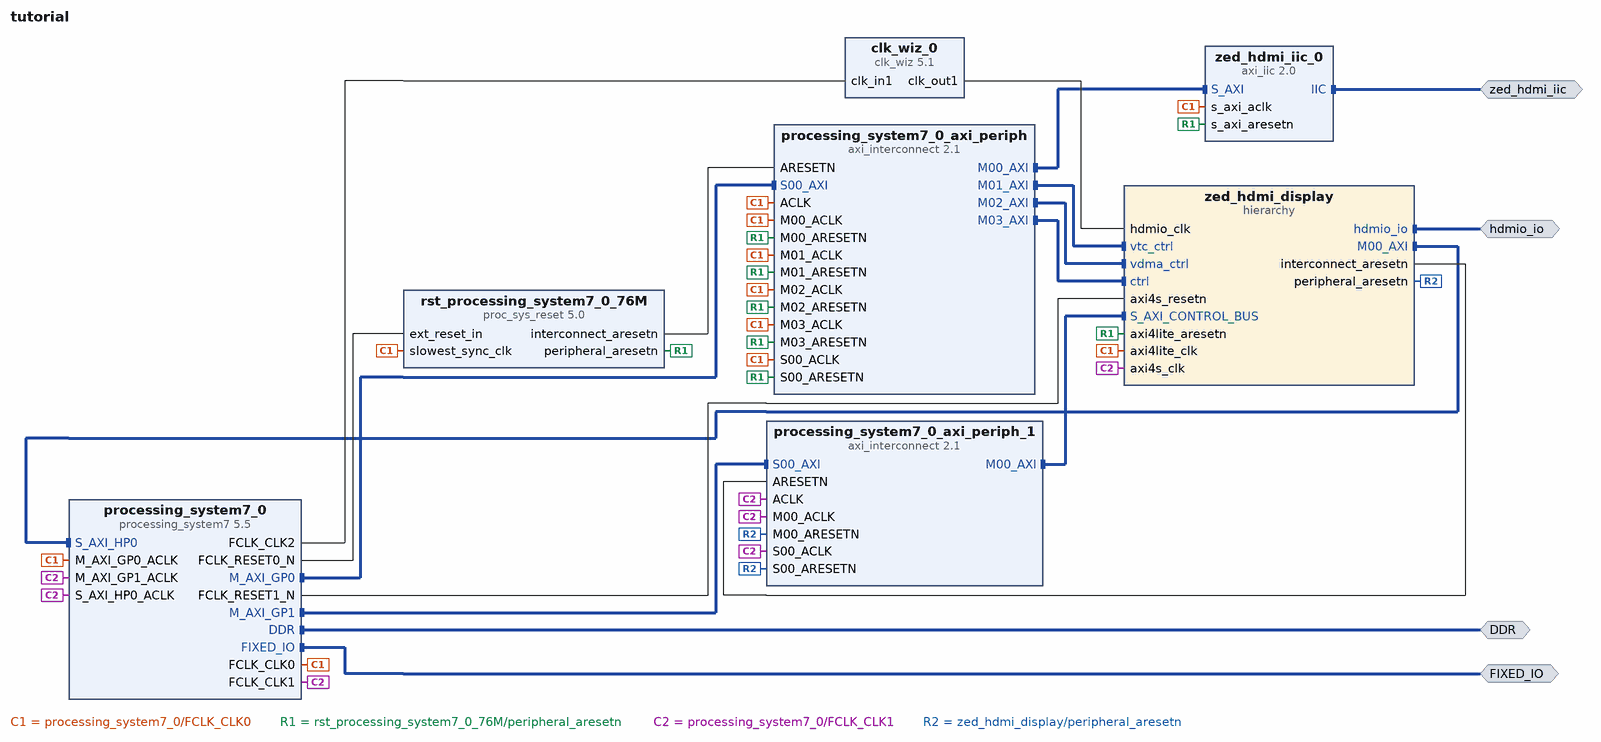
[diagram p0: block diagram of the top level]
# Vivado block design tutorial, Vivado 2014.4.1
create_bd_design tutorial

create_bd_intf_port -mode Master -vlnv xilinx.com:interface:ddrx_rtl:1.0 DDR
create_bd_intf_port -mode Master -vlnv xilinx.com:display_processing_system7:fixedio_rtl:1.0 FIXED_IO
create_bd_intf_port -mode Master -vlnv xilinx.com:interface:iic_rtl:1.0 zed_hdmi_iic
create_bd_intf_port -mode Master -vlnv avnet.com:interface:avnet_hdmi_rtl:1.0 hdmio_io

create_bd_cell -type hier zed_hdmi_display
create_bd_cell -type ip -vlnv xilinx.com:ip:axi_iic:2.0 zed_hdmi_iic_0
create_bd_cell -type ip -vlnv xilinx.com:ip:clk_wiz:5.1 clk_wiz_0
set_property -dict [list \
  CONFIG.CLKOUT1_REQUESTED_OUT_FREQ 148.500 \
  CONFIG.USE_LOCKED false \
  CONFIG.USE_RESET false \
] [get_bd_cells clk_wiz_0]
create_bd_cell -type ip -vlnv xilinx.com:ip:processing_system7:5.5 processing_system7_0
set_property -dict [list \
  CONFIG.PCW_FPGA0_PERIPHERAL_FREQMHZ 75.000000 \
  CONFIG.PCW_FPGA2_PERIPHERAL_FREQMHZ 100.000000 \
  CONFIG.PCW_USE_M_AXI_GP1 1 \
  CONFIG.PCW_USE_S_AXI_HP0 1 \
  CONFIG.PCW_EN_CLK1_PORT 1 \
  CONFIG.PCW_EN_CLK2_PORT 1 \
  CONFIG.PCW_EN_RST1_PORT 1 \
  CONFIG.preset {ZedBoard*} \
] [get_bd_cells processing_system7_0]
create_bd_cell -type ip -vlnv xilinx.com:ip:axi_interconnect:2.1 processing_system7_0_axi_periph
set_property -dict [list \
  CONFIG.NUM_SI 1 \
  CONFIG.NUM_MI 4 \
  CONFIG.STRATEGY 1 \
  CONFIG.ENABLE_ADVANCED_OPTIONS 1 \
] [get_bd_cells processing_system7_0_axi_periph]
create_bd_cell -type ip -vlnv xilinx.com:ip:proc_sys_reset:5.0 rst_processing_system7_0_76M
create_bd_cell -type ip -vlnv xilinx.com:ip:axi_interconnect:2.1 processing_system7_0_axi_periph_1
set_property -dict {CONFIG.NUM_MI 1} [get_bd_cells processing_system7_0_axi_periph_1]

# ---- hierarchy /zed_hdmi_display ----
current_bd_instance /zed_hdmi_display
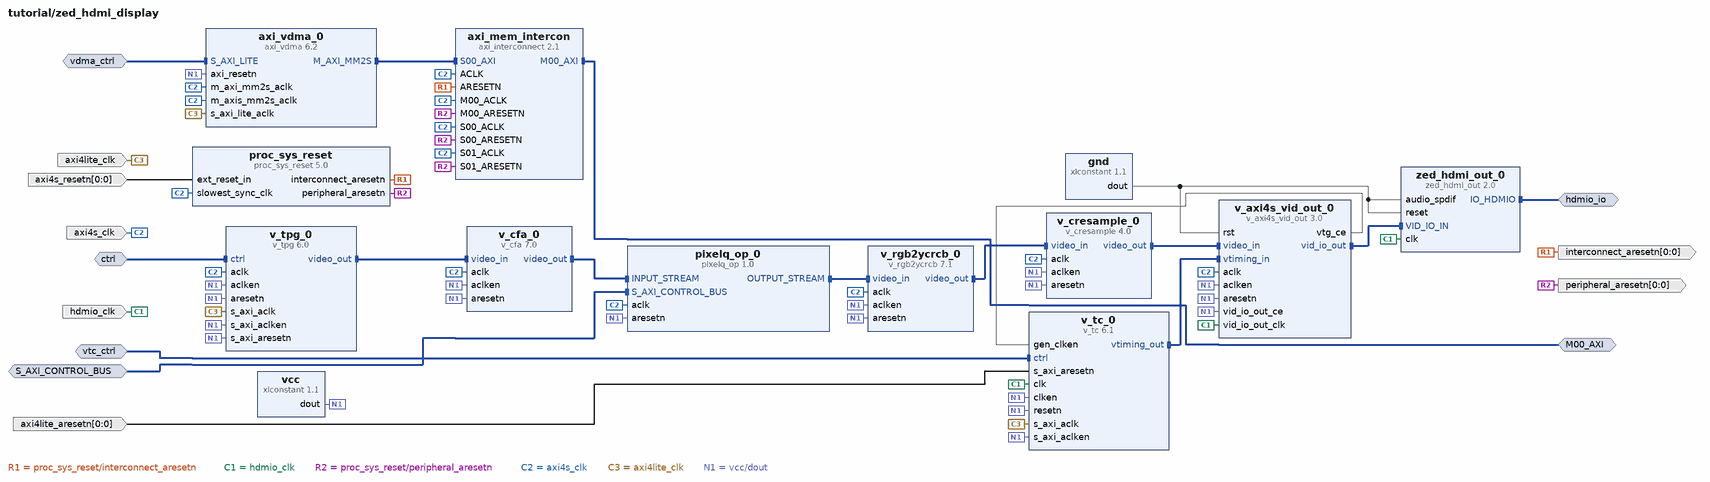
[diagram p1: block diagram inside /zed_hdmi_display]
create_bd_intf_pin -mode Master -vlnv xilinx.com:interface:aximm_rtl:1.0 M00_AXI
create_bd_intf_pin -mode Master -vlnv avnet.com:interface:avnet_hdmi_rtl:1.0 hdmio_io
create_bd_intf_pin -mode Slave -vlnv xilinx.com:interface:aximm_rtl:1.0 vdma_ctrl
create_bd_intf_pin -mode Slave -vlnv xilinx.com:interface:aximm_rtl:1.0 vtc_ctrl
create_bd_intf_pin -mode Slave -vlnv xilinx.com:interface:aximm_rtl:1.0 ctrl
create_bd_intf_pin -mode Slave -vlnv xilinx.com:interface:aximm_rtl:1.0 S_AXI_CONTROL_BUS
create_bd_pin -dir I -from 0 -to 0 axi4lite_aresetn
create_bd_pin -dir I axi4lite_clk
create_bd_pin -dir I -type clk axi4s_clk
create_bd_pin -dir I -from 0 -to 0 axi4s_resetn
create_bd_pin -dir I hdmio_clk
create_bd_pin -dir O -from 0 -to 0 -type rst peripheral_aresetn
create_bd_pin -dir O -from 0 -to 0 -type rst interconnect_aresetn

create_bd_cell -type ip -vlnv avnet:zedboard:zed_hdmi_out:2.0 zed_hdmi_out_0
create_bd_cell -type ip -vlnv xilinx.com:ip:axi_interconnect:2.1 axi_mem_intercon
set_property -dict {CONFIG.NUM_SI 2 CONFIG.NUM_MI 1} [get_bd_cells axi_mem_intercon]
create_bd_cell -type ip -vlnv xilinx.com:ip:axi_vdma:6.2 axi_vdma_0
set_property -dict [list \
  CONFIG.c_mm2s_genlock_mode 0 \
  CONFIG.c_mm2s_linebuffer_depth 4096 \
  CONFIG.c_include_s2mm 0 \
  CONFIG.c_enable_debug_info_6 0 \
  CONFIG.c_enable_debug_info_7 0 \
  CONFIG.c_enable_debug_info_14 0 \
  CONFIG.c_enable_debug_info_15 0 \
  CONFIG.c_include_mm2s_dre 1 \
] [get_bd_cells axi_vdma_0]
create_bd_cell -type ip -vlnv xilinx.com:ip:xlconstant:1.1 gnd
set_property -dict {CONFIG.CONST_VAL 0} [get_bd_cells gnd]
create_bd_cell -type ip -vlnv xilinx.com:ip:proc_sys_reset:5.0 proc_sys_reset
set_property -dict {CONFIG.C_AUX_RESET_HIGH 0} [get_bd_cells proc_sys_reset]
create_bd_cell -type ip -vlnv xilinx.com:ip:v_axi4s_vid_out:3.0 v_axi4s_vid_out_0
set_property -dict {CONFIG.C_S_AXIS_VIDEO_FORMAT 0 CONFIG.VTG_MASTER_SLAVE 1} [get_bd_cells v_axi4s_vid_out_0]
create_bd_cell -type ip -vlnv xilinx.com:ip:v_cresample:4.0 v_cresample_0
set_property -dict {CONFIG.s_axis_video_format 3 CONFIG.m_axis_video_format 2} [get_bd_cells v_cresample_0]
create_bd_cell -type ip -vlnv xilinx.com:ip:v_rgb2ycrcb:7.1 v_rgb2ycrcb_0
create_bd_cell -type ip -vlnv xilinx.com:ip:v_tc:6.1 v_tc_0
set_property -dict {CONFIG.VIDEO_MODE 1080p CONFIG.enable_detection false} [get_bd_cells v_tc_0]
create_bd_cell -type ip -vlnv xilinx.com:ip:xlconstant:1.1 vcc
create_bd_cell -type ip -vlnv xilinx.com:ip:v_tpg:6.0 v_tpg_0
set_property -dict [list \
  CONFIG.has_axi4s_slave false \
  CONFIG.data_width 8 \
  CONFIG.pattern_control 10 \
  CONFIG.m_video_format 12 \
  CONFIG.bayer_phase 2 \
] [get_bd_cells v_tpg_0]
create_bd_cell -type ip -vlnv xilinx.com:ip:v_cfa:7.0 v_cfa_0
set_property -dict [list \
  CONFIG.has_axi4_lite false \
  CONFIG.hor_filt true \
  CONFIG.fringe_tol 0 \
  CONFIG.bayer_phase 2 \
] [get_bd_cells v_cfa_0]
create_bd_cell -type ip -vlnv xilinx.com:hls:pixelq_op:1.0 pixelq_op_0

# ---- connections ----

current_bd_instance /zed_hdmi_display
connect_bd_intf_net [get_bd_intf_pins axi_mem_intercon/S00_AXI] [get_bd_intf_pins axi_vdma_0/M_AXI_MM2S]
connect_bd_intf_net [get_bd_intf_pins v_axi4s_vid_out_0/vid_io_out] [get_bd_intf_pins zed_hdmi_out_0/VID_IO_IN]
connect_bd_intf_net [get_bd_intf_pins v_axi4s_vid_out_0/video_in] [get_bd_intf_pins v_cresample_0/video_out]
connect_bd_intf_net [get_bd_intf_pins v_cresample_0/video_in] [get_bd_intf_pins v_rgb2ycrcb_0/video_out]
connect_bd_intf_net [get_bd_intf_pins v_axi4s_vid_out_0/vtiming_in] [get_bd_intf_pins v_tc_0/vtiming_out]
connect_bd_intf_net [get_bd_intf_pins v_tpg_0/video_out] [get_bd_intf_pins v_cfa_0/video_in]
connect_bd_intf_net [get_bd_intf_pins pixelq_op_0/OUTPUT_STREAM] [get_bd_intf_pins v_rgb2ycrcb_0/video_in]
connect_bd_intf_net [get_bd_intf_pins pixelq_op_0/INPUT_STREAM] [get_bd_intf_pins v_cfa_0/video_out]
connect_bd_intf_net [get_bd_intf_pins M00_AXI] [get_bd_intf_pins axi_mem_intercon/M00_AXI]
connect_bd_intf_net [get_bd_intf_pins hdmio_io] [get_bd_intf_pins zed_hdmi_out_0/IO_HDMIO]
connect_bd_intf_net [get_bd_intf_pins vdma_ctrl] [get_bd_intf_pins axi_vdma_0/S_AXI_LITE]
connect_bd_intf_net [get_bd_intf_pins vtc_ctrl] [get_bd_intf_pins v_tc_0/ctrl]
connect_bd_intf_net [get_bd_intf_pins ctrl] [get_bd_intf_pins v_tpg_0/ctrl]
connect_bd_intf_net [get_bd_intf_pins S_AXI_CONTROL_BUS] [get_bd_intf_pins pixelq_op_0/S_AXI_CONTROL_BUS]
connect_bd_net -net aresetn_1 [get_bd_pins proc_sys_reset/interconnect_aresetn] \
  [get_bd_pins interconnect_aresetn] [get_bd_pins axi_mem_intercon/ARESETN]
connect_bd_net -net clk_1 [get_bd_pins hdmio_clk] \
  [get_bd_pins zed_hdmi_out_0/clk] [get_bd_pins v_axi4s_vid_out_0/vid_io_out_clk] [get_bd_pins v_tc_0/clk]
connect_bd_net -net ext_reset_in_1 [get_bd_pins axi4s_resetn] [get_bd_pins proc_sys_reset/ext_reset_in]
connect_bd_net -net gnd_const [get_bd_pins gnd/dout] \
  [get_bd_pins zed_hdmi_out_0/audio_spdif] [get_bd_pins zed_hdmi_out_0/reset] [get_bd_pins v_axi4s_vid_out_0/rst]
connect_bd_net [get_bd_pins proc_sys_reset/peripheral_aresetn] \
  [get_bd_pins peripheral_aresetn] [get_bd_pins axi_mem_intercon/S00_ARESETN] [get_bd_pins axi_mem_intercon/M00_ARESETN] \
  [get_bd_pins axi_mem_intercon/S01_ARESETN]
connect_bd_net -net processing_system7_0_fclk_clk1 [get_bd_pins axi4s_clk] \
  [get_bd_pins axi_vdma_0/m_axi_mm2s_aclk] [get_bd_pins axi_vdma_0/m_axis_mm2s_aclk] \
  [get_bd_pins proc_sys_reset/slowest_sync_clk] [get_bd_pins v_axi4s_vid_out_0/aclk] [get_bd_pins v_cresample_0/aclk] \
  [get_bd_pins v_rgb2ycrcb_0/aclk] [get_bd_pins v_tpg_0/aclk] [get_bd_pins v_cfa_0/aclk] [get_bd_pins axi_mem_intercon/ACLK] \
  [get_bd_pins axi_mem_intercon/S00_ACLK] [get_bd_pins axi_mem_intercon/M00_ACLK] [get_bd_pins axi_mem_intercon/S01_ACLK] \
  [get_bd_pins pixelq_op_0/aclk]
connect_bd_net -net s_axi_aclk_1 [get_bd_pins axi4lite_clk] \
  [get_bd_pins axi_vdma_0/s_axi_lite_aclk] [get_bd_pins v_tc_0/s_axi_aclk] [get_bd_pins v_tpg_0/s_axi_aclk]
connect_bd_net -net s_axi_aresetn_1 [get_bd_pins axi4lite_aresetn] [get_bd_pins v_tc_0/s_axi_aresetn]
connect_bd_net [get_bd_pins v_axi4s_vid_out_0/vtg_ce] [get_bd_pins v_tc_0/gen_clken]
connect_bd_net -net vcc_const [get_bd_pins vcc/dout] \
  [get_bd_pins axi_vdma_0/axi_resetn] [get_bd_pins v_axi4s_vid_out_0/aclken] [get_bd_pins v_axi4s_vid_out_0/aresetn] \
  [get_bd_pins v_axi4s_vid_out_0/vid_io_out_ce] [get_bd_pins v_cresample_0/aclken] [get_bd_pins v_cresample_0/aresetn] \
  [get_bd_pins v_rgb2ycrcb_0/aclken] [get_bd_pins v_rgb2ycrcb_0/aresetn] [get_bd_pins v_tc_0/clken] \
  [get_bd_pins v_tc_0/s_axi_aclken] [get_bd_pins v_tc_0/resetn] [get_bd_pins v_tpg_0/aresetn] [get_bd_pins v_tpg_0/aclken] \
  [get_bd_pins v_tpg_0/s_axi_aclken] [get_bd_pins v_tpg_0/s_axi_aresetn] [get_bd_pins v_cfa_0/aclken] \
  [get_bd_pins v_cfa_0/aresetn] [get_bd_pins pixelq_op_0/aresetn]

current_bd_instance /
connect_bd_intf_net [get_bd_intf_pins processing_system7_0/M_AXI_GP0] [get_bd_intf_pins processing_system7_0_axi_periph/S00_AXI]
connect_bd_intf_net [get_bd_intf_pins processing_system7_0_axi_periph/M00_AXI] [get_bd_intf_pins zed_hdmi_iic_0/S_AXI]
connect_bd_intf_net [get_bd_intf_pins processing_system7_0_axi_periph/M01_AXI] [get_bd_intf_pins zed_hdmi_display/vtc_ctrl]
connect_bd_intf_net [get_bd_intf_pins processing_system7_0_axi_periph/M02_AXI] [get_bd_intf_pins zed_hdmi_display/vdma_ctrl]
connect_bd_intf_net [get_bd_intf_pins zed_hdmi_display/M00_AXI] [get_bd_intf_pins processing_system7_0/S_AXI_HP0]
connect_bd_intf_net [get_bd_intf_pins processing_system7_0_axi_periph/M03_AXI] [get_bd_intf_pins zed_hdmi_display/ctrl]
connect_bd_intf_net [get_bd_intf_pins processing_system7_0_axi_periph_1/M00_AXI] [get_bd_intf_pins zed_hdmi_display/S_AXI_CONTROL_BUS]
connect_bd_intf_net [get_bd_intf_pins processing_system7_0/M_AXI_GP1] [get_bd_intf_pins processing_system7_0_axi_periph_1/S00_AXI]
connect_bd_intf_net [get_bd_intf_ports DDR] [get_bd_intf_pins processing_system7_0/DDR]
connect_bd_intf_net [get_bd_intf_ports FIXED_IO] [get_bd_intf_pins processing_system7_0/FIXED_IO]
connect_bd_intf_net [get_bd_intf_ports zed_hdmi_iic] [get_bd_intf_pins zed_hdmi_iic_0/IIC]
connect_bd_intf_net [get_bd_intf_ports hdmio_io] [get_bd_intf_pins zed_hdmi_display/hdmio_io]
connect_bd_net [get_bd_pins processing_system7_0/FCLK_CLK0] \
  [get_bd_pins zed_hdmi_display/axi4lite_clk] [get_bd_pins zed_hdmi_iic_0/s_axi_aclk] \
  [get_bd_pins processing_system7_0/M_AXI_GP0_ACLK] [get_bd_pins rst_processing_system7_0_76M/slowest_sync_clk] \
  [get_bd_pins processing_system7_0_axi_periph/ACLK] [get_bd_pins processing_system7_0_axi_periph/S00_ACLK] \
  [get_bd_pins processing_system7_0_axi_periph/M00_ACLK] [get_bd_pins processing_system7_0_axi_periph/M01_ACLK] \
  [get_bd_pins processing_system7_0_axi_periph/M02_ACLK] [get_bd_pins processing_system7_0_axi_periph/M03_ACLK]
connect_bd_net [get_bd_pins processing_system7_0/FCLK_RESET0_N] [get_bd_pins rst_processing_system7_0_76M/ext_reset_in]
connect_bd_net -net rst_processing_system7_0_100M_peripheral_aresetn [get_bd_pins rst_processing_system7_0_76M/peripheral_aresetn] \
  [get_bd_pins zed_hdmi_display/axi4lite_aresetn] [get_bd_pins zed_hdmi_iic_0/s_axi_aresetn] \
  [get_bd_pins processing_system7_0_axi_periph/S00_ARESETN] [get_bd_pins processing_system7_0_axi_periph/M00_ARESETN] \
  [get_bd_pins processing_system7_0_axi_periph/M01_ARESETN] [get_bd_pins processing_system7_0_axi_periph/M02_ARESETN] \
  [get_bd_pins processing_system7_0_axi_periph/M03_ARESETN]
connect_bd_net -net rst_processing_system7_0_100M_interconnect_aresetn [get_bd_pins rst_processing_system7_0_76M/interconnect_aresetn] \
  [get_bd_pins processing_system7_0_axi_periph/ARESETN]
connect_bd_net [get_bd_pins processing_system7_0/FCLK_CLK2] [get_bd_pins clk_wiz_0/clk_in1]
connect_bd_net -net axi4s_clk_1 [get_bd_pins processing_system7_0/FCLK_CLK1] \
  [get_bd_pins zed_hdmi_display/axi4s_clk] [get_bd_pins processing_system7_0/S_AXI_HP0_ACLK] \
  [get_bd_pins processing_system7_0_axi_periph_1/S00_ACLK] [get_bd_pins processing_system7_0_axi_periph_1/ACLK] \
  [get_bd_pins processing_system7_0_axi_periph_1/M00_ACLK] [get_bd_pins processing_system7_0/M_AXI_GP1_ACLK]
connect_bd_net -net axi4s_resetn_1 [get_bd_pins processing_system7_0/FCLK_RESET1_N] [get_bd_pins zed_hdmi_display/axi4s_resetn]
connect_bd_net -net hdmio_clk_1 [get_bd_pins clk_wiz_0/clk_out1] [get_bd_pins zed_hdmi_display/hdmio_clk]
connect_bd_net -net S00_ARESETN_1 [get_bd_pins zed_hdmi_display/peripheral_aresetn] \
  [get_bd_pins processing_system7_0_axi_periph_1/S00_ARESETN] [get_bd_pins processing_system7_0_axi_periph_1/M00_ARESETN]
connect_bd_net -net ARESETN_1 [get_bd_pins zed_hdmi_display/interconnect_aresetn] [get_bd_pins processing_system7_0_axi_periph_1/ARESETN]

# ---- address map ----
assign_bd_address -offset 0x41600000 -range 64K -target_address_space [get_bd_addr_spaces processing_system7_0/Data] [get_bd_addr_segs zed_hdmi_iic_0/S_AXI/Reg]
assign_bd_address -offset 0x43000000 -range 64K -target_address_space [get_bd_addr_spaces processing_system7_0/Data] [get_bd_addr_segs zed_hdmi_display/axi_vdma_0/S_AXI_LITE/Reg]
assign_bd_address -offset 0x43C00000 -range 64K -target_address_space [get_bd_addr_spaces processing_system7_0/Data] [get_bd_addr_segs zed_hdmi_display/v_tc_0/ctrl/Reg]
assign_bd_address -offset 0x43C10000 -range 64K -target_address_space [get_bd_addr_spaces processing_system7_0/Data] [get_bd_addr_segs zed_hdmi_display/v_tpg_0/ctrl/Reg]
assign_bd_address -offset 0x83C00000 -range 64K -target_address_space [get_bd_addr_spaces processing_system7_0/Data] [get_bd_addr_segs zed_hdmi_display/pixelq_op_0/S_AXI_CONTROL_BUS/Reg]
assign_bd_address -offset 0x0 -range 512M -target_address_space [get_bd_addr_spaces zed_hdmi_display/axi_vdma_0/Data_MM2S] [get_bd_addr_segs processing_system7_0/S_AXI_HP0/HP0_DDR_LOWOCM]

validate_bd_design
save_bd_design
